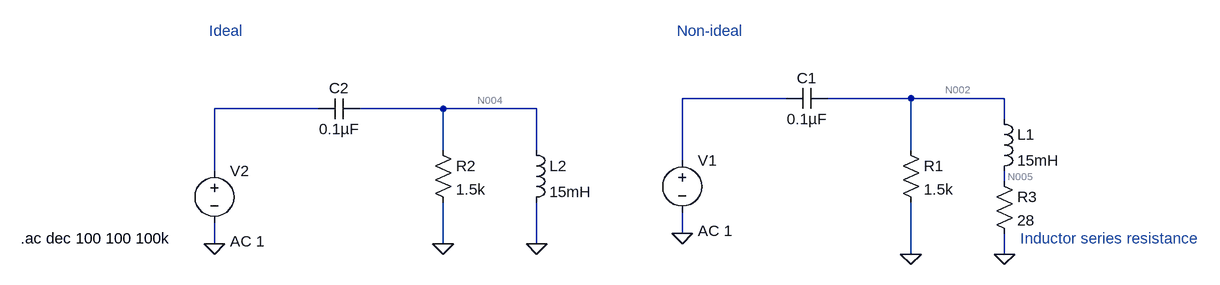
[diagram p0: schematic Draft1.asc]
Draft1.asc, the LTspice schematic file:
Version 4
SHEET 1 904 680
WIRE 240 64 80 64
WIRE 432 64 304 64
WIRE 576 64 432 64
WIRE -480 80 -640 80
WIRE -288 80 -416 80
WIRE -144 80 -288 80
WIRE 576 96 576 64
WIRE -288 144 -288 80
WIRE -144 144 -144 80
WIRE 432 144 432 64
WIRE 80 160 80 64
WIRE -640 176 -640 80
WIRE 576 192 576 176
WIRE 80 272 80 240
WIRE -640 288 -640 256
WIRE -288 288 -288 224
WIRE -144 288 -144 224
WIRE 432 304 432 224
WIRE 576 304 576 272
FLAG 80 272 0
FLAG 432 304 0
FLAG 576 304 0
FLAG -640 288 0
FLAG -288 288 0
FLAG -144 288 0
SYMBOL voltage 80 144 R0
WINDOW 123 24 124 Left 2
WINDOW 39 0 0 Left 0
SYMATTR InstName V1
SYMATTR Value ""
SYMATTR Value2 AC 1
SYMBOL res 416 128 R0
SYMATTR InstName R1
SYMATTR Value 1.5k
SYMBOL ind 560 80 R0
SYMATTR InstName L1
SYMATTR Value 15mH
SYMBOL cap 304 48 R90
WINDOW 0 0 32 VBottom 2
WINDOW 3 32 32 VTop 2
SYMATTR InstName C1
SYMATTR Value 0.1µF
SYMBOL voltage -640 160 R0
WINDOW 123 24 124 Left 2
WINDOW 39 0 0 Left 0
SYMATTR InstName V2
SYMATTR Value ""
SYMATTR Value2 AC 1
SYMBOL res -304 128 R0
SYMATTR InstName R2
SYMATTR Value 1.5k
SYMBOL ind -160 128 R0
SYMATTR InstName L2
SYMATTR Value 15mH
SYMBOL cap -416 64 R90
WINDOW 0 0 32 VBottom 2
WINDOW 3 32 32 VTop 2
SYMATTR InstName C2
SYMATTR Value 0.1µF
SYMBOL res 560 176 R0
SYMATTR InstName R3
SYMATTR Value 28
TEXT -938 280 Left 2 !.ac dec 100 100 100k
TEXT 600 280 Left 2 ;Inductor series resistance
TEXT -648 -40 Left 2 ;Ideal
TEXT 72 -40 Left 2 ;Non-ideal

The netlist it stands for:
* Draft1.asc
V1 N001 0 AC 1
R1 N002 0 1.5k
L1 N002 N005 15mH
C1 N002 N001 0.1µF
V2 N003 0 AC 1
R2 N004 0 1.5k
L2 N004 0 15mH
C2 N004 N003 0.1µF
R3 N005 0 28
.ac dec 100 100 100k
* Inductor series resistance
* Ideal
* Non-ideal
.backanno
.end

* Results of the author's LTspice run, read from the files saved beside the schematic
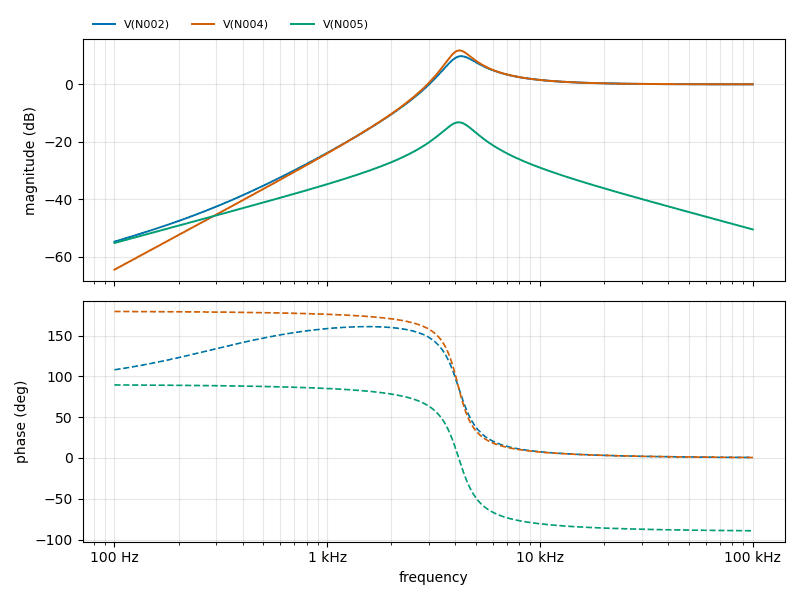
[diagram p1: AC Analysis of Draft1.asc, plotted from the saved traces]
* AC Analysis, 1 run:
*   V(N002): -54.78 dB at 100 Hz, 0.01 dB at 100 kHz, peak 9.84 dB at 4.266 kHz, 3 dB below the peak at 3.681 kHz and 5.251 kHz
*   V(N004): -64.55 dB at 100 Hz, 0.01 dB at 100 kHz, peak 11.83 dB at 4.169 kHz, 3 dB below the peak at 3.716 kHz and 4.875 kHz
*   V(N005): -55.25 dB at 100 Hz, -50.53 dB at 100 kHz, peak -13.21 dB at 4.169 kHz, 3 dB below the peak at 3.523 kHz and 4.883 kHz